# EAGLE board elements_v02 (EAGLE 9.6.2)
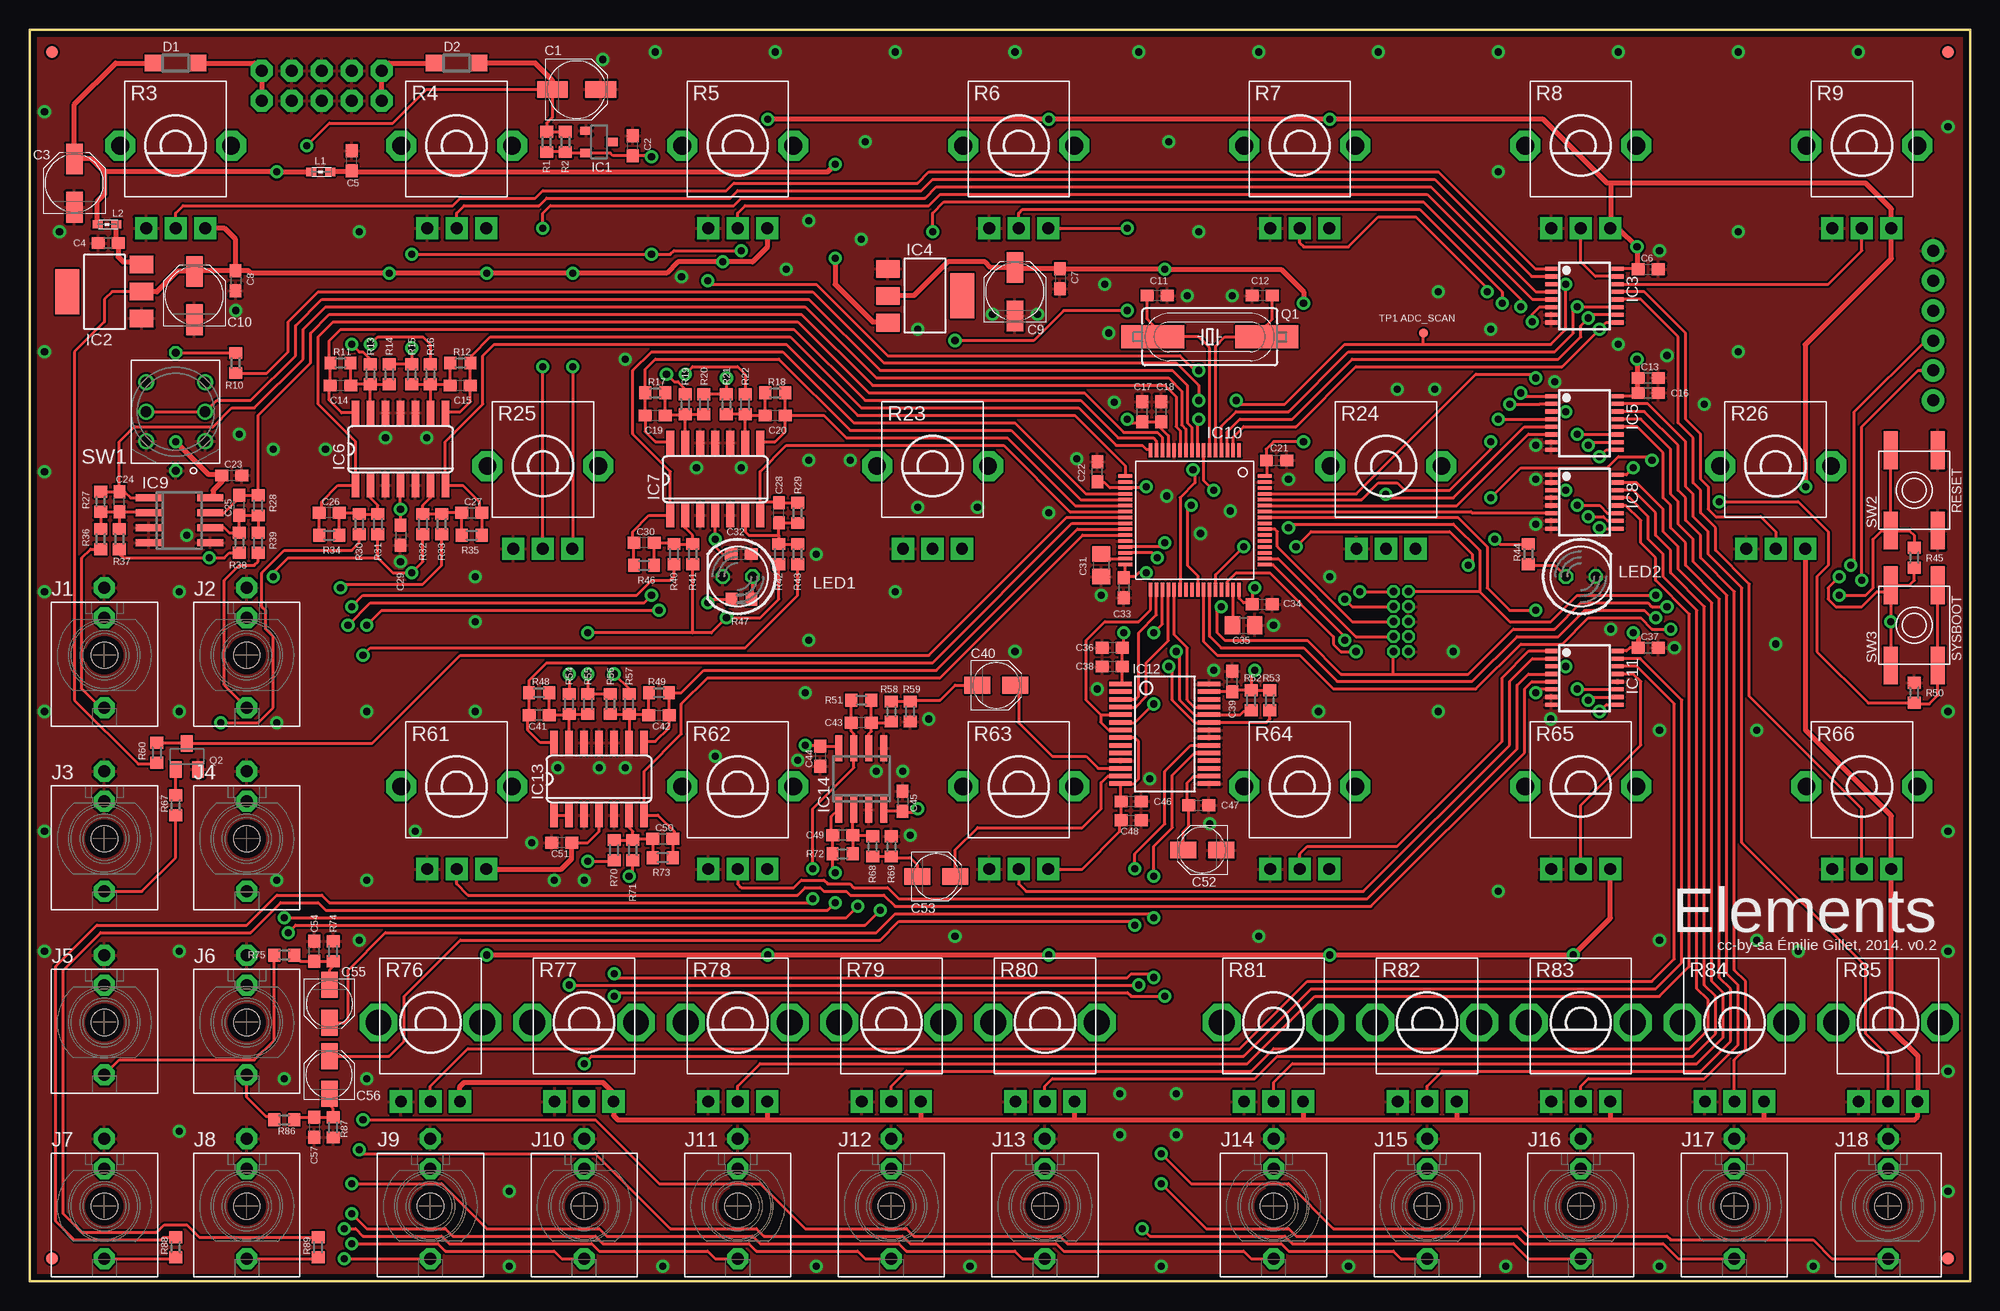
[diagram p5: board, top side]
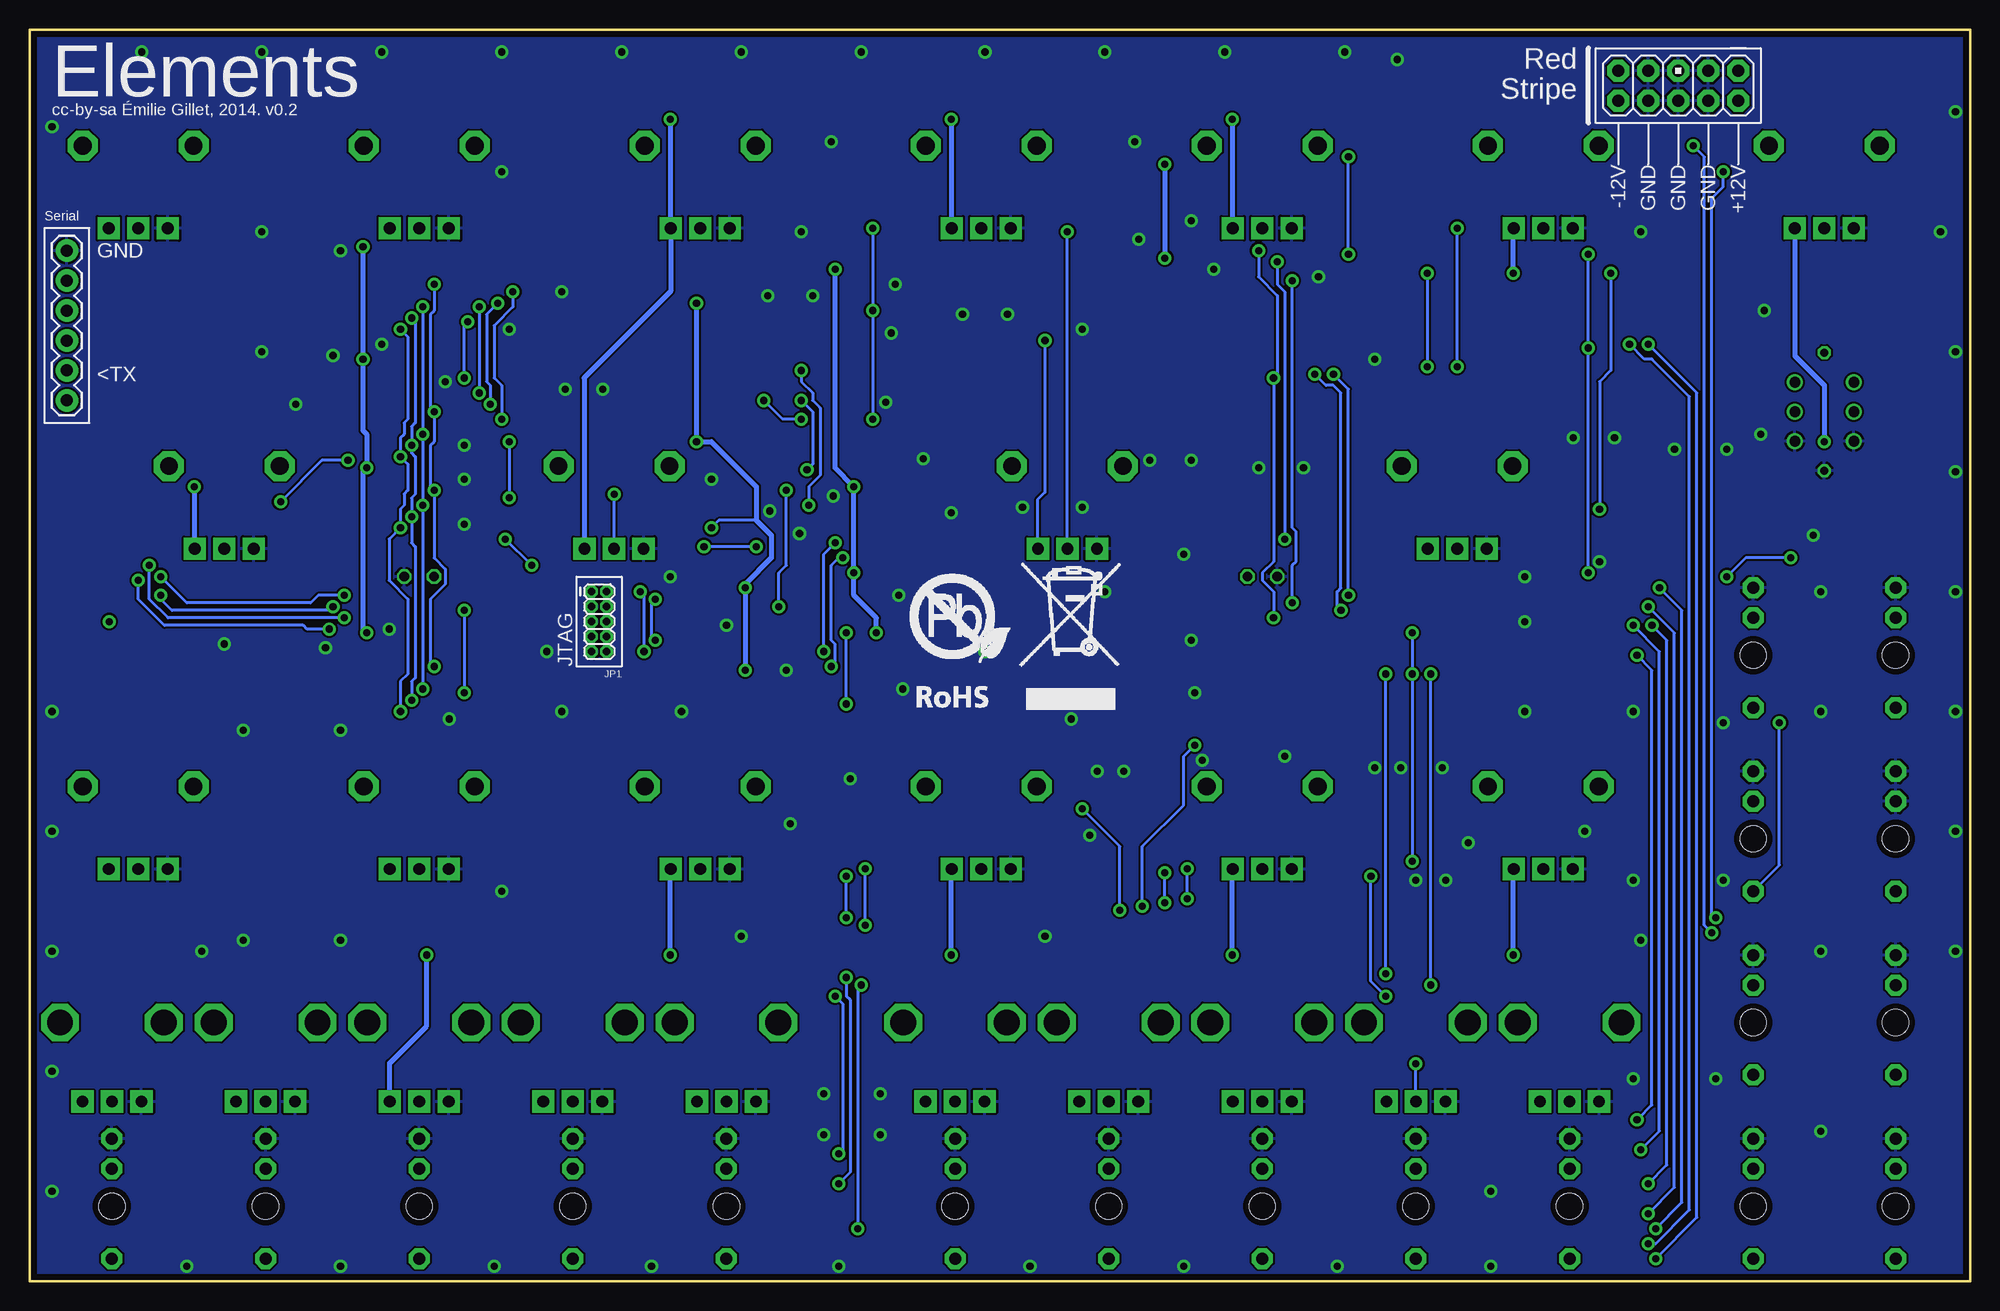
[diagram p6: board, bottom side, seen from below]

Size 164.47 x 106.05 mm. Coordinates in mm from the lower left corner, seen from the top.
Outline: 0,0 164.47,0 164.47,106.05 0,106.05 0,0
Copper layers (1*16): Top 0.035mm / dielectric 1.5mm / Bottom 0.035mm
Design rules "PCBCart-Standard-Fine": minimum track width 8mil, minimum drill 0.4mm, track to track 7mil, track to pad 7mil, pad to pad 7mil, via to via 7mil, smd to smd 7mil, copper to edge 20mil, drill to drill 8mil, minimum pad ring 8mil, minimum via ring 10mil, stop-mask expansion 3mil, vias tented up to drill 25mil, thermal gap 8mil

## Footprints (pad centres in the part's own frame; a part is rotated, then mirrored left to right if it is on the bottom)
PANASONIC_C = smd 2.6 x 1.4: + 2.05,0; - -2.05,0
C0603 = smd 1.1 x 1: 1 -0.85,0; 2 0.85,0
C0805 = smd 1.3 x 1.5: 1 -0.95,0; 2 0.95,0
PANASONIC_B = smd 2.2 x 1.4: + 1.6,0; - -1.6,0
SOD123 = smd 1.4 x 1.4: A 1.9,0; C -1.9,0
FIDUCIAL-1X2 = smd 1 x 1: 1 0,0
DBZ_R-PDSO-G3 = smd 0.7 x 1: 1 -0.95,-1.1; 2 0.95,-1.1; 3 0,1.1
SOT223 = smd 1.499 x 2.007: 1 -2.261,-3.15; 2 0.025,-3.15; 3 2.311,-3.15 | smd 3.81 x 2.007: 4 0,3.15
TSSOP16 = smd 0.35 x 1: 1 -1.95,-2.825; 2 -1.3,-2.825; 3 -0.65,-2.825; 4 0,-2.825; 5 0.65,-2.825; 6 1.3,-2.825; 7 1.95,-2.825; 8 2.6,-2.825; 9 2.6,2.825; 10 1.95,2.825; 11 1.3,2.825; 12 0.65,2.825; 13 0,2.825; 14 -0.65,2.825; 15 -1.3,2.825; 16 -1.95,2.825
SO14 = smd 0.66 x 2.032: 1 -3.81,-3.073; 2 -2.54,-3.073; 3 -1.27,-3.073; 4 0,-3.073; 5 1.27,-3.073; 6 2.54,-3.073; 7 3.81,-3.073; 8 3.81,3.073; 9 2.54,3.073; 10 1.27,3.073; 11 0,3.073; 12 -1.27,3.073; 13 -2.54,3.073; 14 -3.81,3.073
SO08 = smd 0.6 x 2.2: 1 -1.905,-2.6; 2 -0.635,-2.6; 3 0.635,-2.6; 4 1.905,-2.6; 5 1.905,2.6; 6 0.635,2.6; 7 -0.635,2.6; 8 -1.905,2.6
TQFP-10X10-64 = smd 1.2 x 0.3: 1 -5.936,3.75; 2 -5.936,3.25; 3 -5.936,2.75; 4 -5.936,2.25; 5 -5.936,1.75; 6 -5.936,1.25; 7 -5.936,0.75; 8 -5.936,0.25; 9 -5.936,-0.25; 10 -5.936,-0.75; 11 -5.936,-1.25; 12 -5.936,-1.75; 13 -5.936,-2.25; 14 -5.936,-2.75; 15 -5.936,-3.25; 16 -5.936,-3.75; 33 5.886,-3.75; 34 5.886,-3.25; 35 5.886,-2.75; 36 5.886,-2.25; 37 5.886,-1.75; 38 5.886,-1.25; 39 5.886,-0.75; 40 5.886,-0.25; 41 5.886,0.25; 42 5.886,0.75; 43 5.886,1.25; 44 5.886,1.75; 45 5.886,2.25; 46 5.886,2.75; 47 5.886,3.25; 48 5.886,3.75 | smd 0.3 x 1.2: 17 -3.75,-5.911; 18 -3.25,-5.911; 19 -2.75,-5.911; 20 -2.25,-5.911; 21 -1.75,-5.911; 22 -1.25,-5.911; 23 -0.75,-5.911; 24 -0.25,-5.911; 25 0.25,-5.911; 26 0.75,-5.911; 27 1.25,-5.911; 28 1.75,-5.911; 29 2.25,-5.911; 30 2.75,-5.911; 31 3.25,-5.911; 32 3.75,-5.911; 49 3.75,5.936; 50 3.25,5.936; 51 2.75,5.936; 52 2.25,5.936; 53 1.75,5.936; 54 1.25,5.936; 55 0.75,5.936; 56 0.25,5.936; 57 -0.25,5.936; 58 -0.75,5.936; 59 -1.25,5.936; 60 -1.75,5.936; 61 -2.25,5.936; 62 -2.75,5.936; 63 -3.25,5.936; 64 -3.75,5.936
SSOP28 = smd 0.381 x 1.905: 1 -4.55,-3.752; 2 -3.9,-3.752; 3 -3.25,-3.752; 4 -2.6,-3.752; 5 -1.95,-3.752; 6 -1.3,-3.752; 7 -0.65,-3.752; 8 0,-3.752; 9 0.65,-3.752; 10 1.3,-3.752; 11 1.95,-3.752; 12 2.6,-3.752; 13 3.25,-3.752; 14 3.9,-3.752; 15 3.9,3.752; 16 3.25,3.752; 17 2.6,3.752; 18 1.95,3.752; 19 1.3,3.752; 20 0.65,3.752; 21 0,3.752; 22 -0.65,3.752; 23 -1.3,3.752; 24 -1.95,3.752; 25 -2.6,3.752; 26 -3.25,3.752; 27 -3.9,3.752; 28 -4.55,3.752
WQP_PJ_301M6 = drill 1.016 pad 1.778 octagon: P1 0,-5.715; P2 0,-3.175; P3 0,4.445 | hole 2.2: 0,0
2X5-1.27 = drill 0.61 pad 1.067 octagon: 1 -1.27,3.81; 2 0,3.81; 3 -1.27,2.54; 4 0,2.54; 5 -1.27,1.27; 6 0,1.27; 7 -1.27,0; 8 0,0; 9 -1.27,-1.27; 10 0,-1.27
1X06 = drill 1.016 pad 1.88: 1 0,0; 2 2.54,0; 3 5.08,0; 4 7.62,0; 5 10.16,0; 6 12.7,0
AVR_ICSP = drill 1.016 pad 1.88 octagon: 1 -1.27,5.08; 2 1.27,5.08; 3 -1.27,2.54; 4 1.27,2.54; 5 -1.27,0; 6 1.27,0; 7 -1.27,-2.54; 8 1.27,-2.54; 9 -1.27,-5.08; 10 1.27,-5.08
0603 = smd 0.85 x 0.7: 1 -0.9,0; 2 0.7,0
LED5MM = drill 0.813 octagon: A -1.27,0; K 1.27,0
HC49UP = smd 5.334 x 1.93: 1 -4.826,0; 2 4.826,0
SOT23-BEC = smd 1 x 1.4: B -0.95,-1.1; C 0,1.1; E 0.95,-1.1
R0603 = smd 1 x 1.1: 1 -0.85,0; 2 0.85,0
ALPS_POT_VERTICAL_PS = drill 1 pad 1.88 square: P$1 -2.5,7; P$2 0,7; P$3 2.5,7 | drill 1.5 pad 2.54 octagon: P$4 -4.7,0; P$5 4.7,0
ALPS_POT_VERTICAL = drill 1 pad 1.88 square: P$1 -2.5,6.7; P$2 0,6.7; P$3 2.5,6.7 | drill 2.2 pad 3.175 octagon: P$4 -4.4,0; P$5 4.4,0
LP4OA1PBCT = drill 0.7 octagon: L1 5,0; L2 -5,0 | drill 0.9: P1 2.5,2.5; P2 0,2.5; P3 -2.5,2.5; P4 2.5,-2.5; P5 0,-2.5; P6 -2.5,-2.5
EVQ-Q2 = smd 3.2 x 1.2: A -3.4,-2; A' 3.4,-2; B -3.4,2; B' 3.4,2
PAD.03X.03 = smd 0.762 x 0.762: P$1 0,0

## Placement (x,y rotation side)
C1  22u  [PANASONIC_C]  46.35,100.97 0 top
C2  100n  [C0603]  51.12,96.2 90 top
C3  22u  [PANASONIC_C]  3.81,93.03 90 top
C4  100n  [C0603]  6.67,87.95 180 top
C5  100n  [C0603]  27.3,94.93 90 top
C6  100n  [C0603]  137.16,85.72 0 top
C7  100n  [C0603]  87.31,84.93 270 top
C8  100n  [C0603]  17.46,84.77 270 top
C9  22u  [PANASONIC_C]  83.5,83.82 90 top
C10  22u  [PANASONIC_C]  13.97,83.5 90 top
C11  18p  [C0603]  95.57,83.5 180 top
C12  18p  [C0603]  104.46,83.5 0 top
C13  100n  [C0603]  137.16,76.52 0 top
C14  3.3n  [C0603]  26.35,75.88 180 top
C15  3.3n  [C0603]  36.51,75.88 0 top
C16  100n  [C0603]  137.16,75.25 0 top
C17  1u  [C0603]  94.3,73.66 90 top
C18  100n  [C0603]  95.89,73.66 90 top
C19  3.3n  [C0603]  53.02,73.34 180 top
C20  3.3n  [C0603]  63.18,73.34 0 top
C21  100n  [C0603]  105.66,69.53 0 top
C22  100n  [C0603]  90.49,68.58 90 top
C23  100n  [C0603]  17.14,68.26 0 top
C24  3.3n  [C0603]  7.62,66.04 90 top
C25  3.3n  [C0603]  17.78,65.72 90 top
C26  3.3n  [C0603]  25.4,65.09 180 top
C27  3.3n  [C0603]  37.47,65.09 0 top
C28  3.3n  [C0603]  63.5,65.09 90 top
C29  100n  [C0603]  31.43,63.18 270 top
C30  3.3n  [C0603]  52.07,62.55 180 top
C31  2.2u  [C0805]  90.81,60.64 270 top
C32  100n  [C0603]  60.33,61.59 0 top
C33  100n  [C0603]  92.71,58.74 270 top
C34  100n  [C0603]  104.46,57.34 0 top
C35  2.2u  [C0805]  102.87,55.56 0 top
C36  1u  [C0603]  91.76,53.66 180 top
C37  100n  [C0603]  137.16,53.66 0 top
C38  100n  [C0603]  91.76,52.07 180 top
C39  100n  [C0603]  101.92,50.8 90 top
C40  10u  [PANASONIC_B]  81.92,50.48 0 top
C41  3.3n  [C0603]  43.18,47.94 180 top
C42  3.3n  [C0603]  53.34,47.94 0 top
C43  18p  [C0603]  70.48,47.31 180 top
C44  100n  [C0603]  66.99,44.45 270 top
C45  100n  [C0603]  73.98,40.64 270 top
C46  100n  [C0603]  93.34,40.64 0 top
C47  100n  [C0603]  99.06,40.32 0 top
C48  1u  [C0603]  93.34,39.05 0 top
C49  18p  [C0603]  68.9,37.78 180 top
C50  3.3n  [C0603]  53.66,37.47 0 top
C51  100n  [C0603]  45.09,37.15 180 top
C52  10u  [PANASONIC_B]  99.38,36.51 180 top
C53  10u  [PANASONIC_B]  76.83,34.29 0 top
C54  220p  [C0603]  24.13,27.94 90 top
C55  10u  [PANASONIC_B]  25.4,23.5 270 top
C56  10u  [PANASONIC_B]  25.4,17.46 90 top
C57  220p  [C0603]  24.13,13.02 270 top
D1  1N5819HW  [SOD123]  12.38,103.19 0 top
D2  1N5819HW  [SOD123]  36.2,103.19 0 top
F1  FIDUCIAL1X2  [FIDUCIAL-1X2]  1.91,104.14 0 top
F2  FIDUCIAL1X2  [FIDUCIAL-1X2]  162.56,104.14 0 top
F3  FIDUCIAL1X2  [FIDUCIAL-1X2]  1.91,1.91 0 top
F4  FIDUCIAL1X2  [FIDUCIAL-1X2]  162.56,1.91 0 top
IC1  LM4040B10  [DBZ_R-PDSO-G3]  48.26,96.52 270 top
IC2  LM1117-3.3  [SOT223]  6.35,83.82 90 top
IC3  4051PW  [TSSOP16]  131.76,83.82 270 top
IC4  LM1117-3.3  [SOT223]  75.88,83.5 270 top
IC5  4051PW  [TSSOP16]  131.76,73.03 270 top
IC6  MCP6004  [SO14]  31.43,70.48 0 top
IC7  MCP6004  [SO14]  58.1,67.94 0 top
IC8  4051PW  [TSSOP16]  131.76,66.36 270 top
IC9  MCP6002  [SO08]  12.7,64.45 270 top
IC10  STM32F405RGT6  [TQFP-10X10-64]  98.74,64.45 270 top
IC11  4051PW  [TSSOP16]  131.76,51.44 270 top
IC12  WM8731  [SSOP28]  96.2,46.04 270 top
IC13  MCP6004  [SO14]  48.26,42.55 0 top
IC14  LME49720  [SO08]  70.48,42.55 0 top
J1  PJ301_THONKICONN6  [WQP_PJ_301M6]  6.35,53.02 180 top
J2  PJ301_THONKICONN6  [WQP_PJ_301M6]  18.41,53.02 180 top
J3  PJ301_THONKICONN6  [WQP_PJ_301M6]  6.35,37.47 180 top
J4  PJ301_THONKICONN6  [WQP_PJ_301M6]  18.41,37.47 180 top
J5  PJ301_THONKICONN6  [WQP_PJ_301M6]  6.35,21.91 180 top
J6  PJ301_THONKICONN6  [WQP_PJ_301M6]  18.41,21.91 180 top
J7  PJ301_THONKICONN6  [WQP_PJ_301M6]  6.35,6.35 180 top
J8  PJ301_THONKICONN6  [WQP_PJ_301M6]  18.41,6.35 180 top
J9  PJ301_THONKICONN6  [WQP_PJ_301M6]  33.97,6.35 180 top
J10  PJ301_THONKICONN6  [WQP_PJ_301M6]  46.99,6.35 180 top
J11  PJ301_THONKICONN6  [WQP_PJ_301M6]  60.01,6.35 180 top
J12  PJ301_THONKICONN6  [WQP_PJ_301M6]  73.03,6.35 180 top
J13  PJ301_THONKICONN6  [WQP_PJ_301M6]  86.04,6.35 180 top
J14  PJ301_THONKICONN6  [WQP_PJ_301M6]  105.41,6.35 180 top
J15  PJ301_THONKICONN6  [WQP_PJ_301M6]  118.43,6.35 180 top
J16  PJ301_THONKICONN6  [WQP_PJ_301M6]  131.44,6.35 180 top
J17  PJ301_THONKICONN6  [WQP_PJ_301M6]  144.46,6.35 180 top
J18  PJ301_THONKICONN6  [WQP_PJ_301M6]  157.48,6.35 180 top
JP1  M05X2MINIJTAG  [2X5-1.27]  115.57,54.61 0 bottom
JP2  [1X06]  161.29,87.31 270 bottom
JP3  M05X2PTH  [AVR_ICSP]  24.77,101.28 270 bottom
L1  [0603]  24.77,93.98 0 top
L2  [0603]  6.67,89.53 0 top
LED1  SSL-LX5093TC  [LED5MM]  60.01,59.69 180 top
LED2  SSL-LX5093PC  [LED5MM]  131.44,59.69 0 top
Q1  8MHz  [HC49UP]  100.01,80.01 0 top
Q2  MMBT3904  [SOT23-BEC]  13.34,44.45 0 top
R1  1.0k  [R0603]  43.81,96.52 270 top
R2  1.0k  [R0603]  45.4,96.52 270 top
R3  10kB  [ALPS_POT_VERTICAL_PS]  12.38,96.2 180 top
R4  10kB  [ALPS_POT_VERTICAL_PS]  36.2,96.2 180 top
R5  10kB  [ALPS_POT_VERTICAL_PS]  60.01,96.2 180 top
R6  10kB  [ALPS_POT_VERTICAL_PS]  83.82,96.2 180 top
R7  10kB  [ALPS_POT_VERTICAL_PS]  107.63,96.2 180 top
R8  10kB  [ALPS_POT_VERTICAL_PS]  131.44,96.2 180 top
R9  10kB  [ALPS_POT_VERTICAL_PS]  155.26,96.2 180 top
R10  33  [R0603]  17.46,77.79 90 top
R11  20k  [R0603]  26.35,77.79 0 top
R12  20k  [R0603]  36.51,77.79 180 top
R13  100k  [R0603]  28.89,76.83 90 top
R14  120k  [R0603]  30.48,76.83 90 top
R15  120k  [R0603]  32.38,76.83 90 top
R16  100k  [R0603]  33.97,76.83 90 top
R17  20k  [R0603]  53.02,75.25 0 top
R18  20k  [R0603]  63.18,75.25 180 top
R19  100k  [R0603]  55.56,74.3 90 top
R20  120k  [R0603]  57.15,74.3 90 top
R21  120k  [R0603]  59.05,74.3 90 top
R22  100k  [R0603]  60.64,74.3 90 top
R23  10kB  [ALPS_POT_VERTICAL_PS]  76.52,69.06 180 top
R24  10kB  [ALPS_POT_VERTICAL_PS]  114.94,69.06 180 top
R25  10kB  [ALPS_POT_VERTICAL_PS]  43.5,69.06 180 top
R26  10kB  [ALPS_POT_VERTICAL_PS]  147.96,69.06 180 top
R27  47k  [R0603]  6.03,66.04 270 top
R28  20k  [R0603]  19.37,65.72 270 top
R29  20k  [R0603]  65.09,65.09 270 top
R30  100k  [R0603]  27.94,64.14 270 top
R31  200k  [R0603]  29.53,64.14 270 top
R32  120k  [R0603]  33.34,64.14 270 top
R33  100k  [R0603]  34.92,64.14 270 top
R34  33k  [R0603]  25.4,63.18 0 top
R35  20k  [R0603]  37.47,63.18 180 top
R36  100k  [R0603]  6.03,62.87 270 top
R37  180k  [R0603]  7.62,62.87 270 top
R38  120k  [R0603]  17.78,62.55 270 top
R39  100k  [R0603]  19.37,62.55 270 top
R40  100k  [R0603]  54.61,61.59 270 top
R41  120k  [R0603]  56.2,61.59 270 top
R42  120k  [R0603]  63.5,61.59 270 top
R43  100k  [R0603]  65.09,61.59 270 top
R44  2.2k  [R0603]  127,61.59 270 top
R45  10k  [R0603]  159.7,61.28 270 top
R46  20k  [R0603]  52.07,60.64 0 top
R47  2.2k  [R0603]  60.33,57.78 0 top
R48  20k  [R0603]  43.18,49.85 0 top
R49  20k  [R0603]  53.34,49.85 180 top
R50  10k  [R0603]  159.7,49.85 270 top
R51  47k  [R0603]  70.48,49.21 0 top
R52  2.2k  [R0603]  103.5,49.21 90 top
R53  2.2k  [R0603]  105.09,49.21 90 top
R54  100k  [R0603]  45.72,48.9 90 top
R55  120k  [R0603]  47.31,48.9 90 top
R56  120k  [R0603]  49.21,48.9 90 top
R57  100k  [R0603]  50.8,48.9 90 top
R58  6.8k  [R0603]  73.03,48.26 90 top
R59  47k  [R0603]  74.61,48.26 90 top
R60  10k  [R0603]  10.79,44.77 270 top
R61  10kB  [ALPS_POT_VERTICAL_PS]  36.2,41.91 180 top
R62  10kB  [ALPS_POT_VERTICAL_PS]  60.01,41.91 180 top
R63  10kB  [ALPS_POT_VERTICAL_PS]  83.82,41.91 180 top
R64  10kB  [ALPS_POT_VERTICAL_PS]  107.63,41.91 180 top
R65  10kB  [ALPS_POT_VERTICAL_PS]  131.44,41.91 180 top
R66  10kB  [ALPS_POT_VERTICAL_PS]  155.26,41.91 180 top
R67  100k  [R0603]  12.38,40.32 90 top
R68  6.8k  [R0603]  71.44,36.83 270 top
R69  47k  [R0603]  73.03,36.83 270 top
R70  120k  [R0603]  49.53,36.51 270 top
R71  100k  [R0603]  51.12,36.51 270 top
R72  47k  [R0603]  68.9,36.2 0 top
R73  20k  [R0603]  53.66,35.88 180 top
R74  6.8k  [R0603]  25.72,27.94 270 top
R75  36k  [R0603]  21.59,27.62 180 top
R76  10kB  [ALPS_POT_VERTICAL]  33.97,21.91 180 top
R77  10kB  [ALPS_POT_VERTICAL]  46.99,21.91 180 top
R78  10kB  [ALPS_POT_VERTICAL]  60.01,21.91 180 top
R79  10kB  [ALPS_POT_VERTICAL]  73.03,21.91 180 top
R80  10kB  [ALPS_POT_VERTICAL]  86.04,21.91 180 top
R81  10kB  [ALPS_POT_VERTICAL]  105.41,21.91 180 top
R82  10kB  [ALPS_POT_VERTICAL]  118.43,21.91 180 top
R83  10kB  [ALPS_POT_VERTICAL]  131.44,21.91 180 top
R84  10kB  [ALPS_POT_VERTICAL]  144.46,21.91 180 top
R85  10kB  [ALPS_POT_VERTICAL]  157.48,21.91 180 top
R86  36k  [R0603]  21.59,13.65 180 top
R87  6.8k  [R0603]  25.72,13.02 90 top
R88  1.0k  [R0603]  12.38,2.86 90 top
R89  1.0k  [R0603]  24.45,2.86 90 top
SW1  LP4OA1PBCT  [LP4OA1PBCT]  12.38,73.66 90 top
SW2  [EVQ-Q2]  159.7,66.99 90 top
SW3  [EVQ-Q2]  159.7,55.56 90 top
TP1  ADC_TEST  [PAD.03X.03]  118.11,80.33 0 top
U$2  [ROHS_BIG]  91.12,47.62 0 bottom

## Tracks (layer width: path | path; a pad name or v marks a point on that pad's centre or on a via)
+3V3  (via drill 0.6)
  Top 0.254: R45.2 159.7,59.37 159.29,58.96 SW3.B' | R52.2 R53.2 | R52.2 102.03,50.06 C39.1 101.91,49.94 IC12.27 | IC10.48 102.49,57.84 102.87,57.47 103.48,57.47 C34.1 103.61,58.52 v103.82,58.74 | 122.87,58.42 JP1.1 | 122.87,58.42 125.41,55.88 128.91,55.88 131.13,58.1 v137.79,58.1 | R52.2 103.5,51.44 v103.82,51.75 | IC10.64 104.81,68.34 C21.1 104.78,69.57 104.78,70.48 105.41,71.12 v107.95,71.12 | IC12.1 92.61,50.74 C38.1 C36.1 92.71,53.76 v92.71,54.93 | 92.81,59.69 C33.1 | 92.81,59.69 93.66,59.69 93.98,60.01 v94.61,60.01 | 92.81,59.69 92.83,59.71 IC10.32 | v94.61,67.31 94.51,67.2 IC10.19 91.55,67.2 91.12,67.63 90.59,67.63 C22.1 | SW3.B' v157.7,55.88 SW3.B | v106.68,63.82 107,64.14 120.65,64.14 122.87,61.91 122.87,58.42 | SW3.B' 157.16,58.42 156.53,58.42 155.26,57.15 153.03,57.15 152.4,57.78 152.4,58.74 v153.35,59.69
  Top 0.406: IC4.2 72.76,83.5 74.93,83.5 77.79,86.36 80.96,86.36 81.45,85.87 C9.+ 83.59,85.78 C7.1 87.37,85.72 v96.2,85.72 106.05,85.72 107.95,83.82 v107.95,82.87
  Bottom 0.254: v153.35,59.69 151.13,57.47 140.65,57.47 140.02,58.1 v137.79,58.1 | v106.68,63.82 106.05,64.45 102.87,64.45
  Bottom 0.406: v107.95,82.87 v107.95,71.12 106.68,71.12 102.87,67.31 102.87,64.45 101.6,63.18 101.6,61.28 103.82,59.05 v103.82,58.74 v103.82,51.75 | v92.71,54.93 92.71,56.2 94.61,58.1 v94.61,60.01 v94.61,67.31 96.2,68.9 v96.2,85.72
+3V3_A  (via drill 0.6)
  Top 0.254: C37.1 136.26,53.7 136.22,53.66 135.57,53.66 135.3,53.38 IC11.16 | 136.21,85.83 136.15,85.77 IC3.16 | IC5.16 135.83,74.97 136.21,75.35 136.31,75.45 C13.1 | IC12.8 93.66,46.04 93.98,45.72 93.98,42.55 93.57,42.14 IC12.14 92.45,40.69 C46.1 C48.1 92.39,38.95 92.39,38.1 89.2,34.91 R63.P$1 | C18.1 95.89,72.23 96.49,71.62 IC10.13 | C18.1 | C18.1 C17.1 94.19,72.71 93.34,72.71 v93.03,73.03 | v93.03,89.22 93.01,89.2 R6.P$1 | C29.1 v31.43,65.41 IC6.4 | C51.1 47.31,37.15 48.26,38.1 IC13.4 | R60.2 10.69,43.81 9.21,43.81 3.81,49.21 3.81,78.74 6.35,81.28 6.35,83.19 7.01,83.84 IC2.2 | R25.P$1 46.04,62.1 v46.04,77.47 | IC7.4 v58.1,62.87 58.1,62.23 58.74,61.59 C32.1 | v78.42,79.69 85.09,79.69 87.63,82.23 v93.03,82.23 | v135.89,68.9 135.3,68.31 IC8.16
  Top 0.406: 88.58,13.65 107.95,13.65 | 107.95,13.65 120.97,13.65 | 120.97,13.65 133.99,13.65 | 133.99,13.65 147,13.65 | 147,13.65 159.7,13.65 159.98,13.93 R85.P$1 160.02,15.25 160.02,19.05 157.76,21.31 R66.P$1 157.76,39.41 150.5,46.67 150.5,62.02 R26.P$1 | R84.P$1 147,15.17 147,13.65 | R83.P$1 133.99,15.17 133.99,13.65 | R82.P$1 120.97,15.17 120.97,13.65 | R81.P$1 107.95,15.17 107.95,13.65 | R80.P$1 88.58,15.17 88.58,13.65 | v62.55,98.42 v86.36,98.42 v110.17,98.42 128.27,98.42 133.67,93.03 133.99,93.03 | C8.1 14.04,85.62 C10.+ 12.53,85.55 10.79,83.82 9.53,83.82 IC2.2 | C6.1 136.21,85.83 v136.21,87.63 134.63,89.2 R8.P$1 133.99,89.24 133.99,93.03 | C16.1 136.21,75.35 v136.21,78.11 | v38.73,27.62 v62.55,27.62 v86.36,27.62 v110.17,27.62 v130.81,27.62 133.94,30.76 R65.P$1 | 133.99,93.03 155.57,93.03 157.76,90.84 R9.P$1 157.76,86.64 150.46,79.33 150.5,79.3 v150.5,67.31 | R76.P$1 36.47,16.47 36.83,16.83 48.58,16.83 49.49,15.91 R77.P$1 49.49,14.01 49.85,13.65 62.55,13.65 | 62.55,15.25 R78.P$1 62.55,15.17 62.55,13.65 | 75.56,13.65 88.58,13.65 | R79.P$1 75.56,15.17 75.56,13.65 | C51.1 45.94,35.77 45.07,34.91 R61.P$1 | R5.P$1 62.51,87.59 61.28,86.36 v58.74,86.36 54.93,86.36 53.98,85.41 v46.04,85.41 v38.73,85.41 v30.48,85.41 18.73,85.41 18.52,85.62 C8.1 | v12.38,71.12 15.14,68.36 16.3,68.36 C23.1 16.3,67.73 15.56,66.99 15.56,66.61 IC9.8 | C8.1 17.46,88.27 16.52,89.2 R3.P$1 | 62.55,13.65 75.56,13.65 | v135.89,54.93 136.31,54.51 C37.1
  Bottom 0.254: v93.03,89.22 v93.03,82.23 v93.03,73.03 | v31.43,65.41 31.43,76.2 30.48,77.15 v30.48,85.41 | v46.04,85.41 v46.04,77.47 | v58.74,86.36 58.74,84.45 58.1,83.82 v58.1,62.87 | R23.P$1 79.06,62.1 79.06,66.2 78.42,66.83 v78.42,79.69
  Bottom 0.406: R5.P$1 62.55,89.24 v62.55,98.42 | R6.P$1 86.36,89.24 v86.36,98.42 | v110.17,98.42 110.17,89.24 R7.P$1 110.13,83.86 117.47,76.52 117.47,62.1 R24.P$1 | v135.89,54.93 136.21,55.24 136.21,68.58 v135.89,68.9 135.89,71.75 136.21,72.07 v136.21,78.11 v136.21,87.63 | R9.P$1 157.8,89.24 | R83.P$1 133.94,18.45 130.81,21.59 v130.81,27.62 | R61.P$1 38.73,34.87 v38.73,27.62 | R62.P$1 62.55,34.87 v62.55,27.62 | R63.P$1 86.36,34.87 v86.36,27.62 | R64.P$1 110.17,34.87 v110.17,27.62 | v150.5,67.31 150.46,67.27 R26.P$1 | v12.38,71.12 12.38,75.88 14.88,78.38 R3.P$1 | R4.P$1 38.73,89.16 v38.73,85.41
ADC_ADDR_0  (via drill 0.6)
  Top 0.254: IC3.11 134.56,82.55 v131.13,82.55 130.81,82.23 130.81,80.33 129.22,78.74 111.76,78.74 106.68,73.66 102.23,73.66 100.99,72.42 IC10.4 100.97,70.42 | v131.13,50.16 131.16,50.13 IC11.11 | IC5.11 134.56,71.75 v131.13,71.75 | 134.56,65.09 IC8.11 133.7,65.06 133.03,65.72 v131.13,65.72
  Bottom 0.254: v131.13,50.16 v131.13,65.72 v131.13,71.75 v131.13,82.55
ADC_ADDR_1  (via drill 0.6)
  Top 0.254: IC3.10 134.54,81.92 132.4,81.92 v132.08,81.6 131.44,80.96 131.44,80.01 129.54,78.11 112.08,78.11 107,73.03 102.55,73.03 101.49,71.97 IC10.3 | v132.08,49.21 132.35,49.48 IC11.10 | v132.08,70.8 132.35,71.08 IC5.10 | v132.08,64.77 133.35,64.77 133.71,64.41 IC8.10
  Bottom 0.254: v132.08,49.21 132.08,50.8 131.76,51.12 131.76,62.23 132.08,62.55 v132.08,64.77 132.08,66.36 131.76,66.67 131.76,69.85 132.08,70.17 v132.08,70.8 132.08,72.39 131.76,72.71 131.76,81.28 v132.08,81.6
ADC_ADDR_2  (via drill 0.6)
  Top 0.254: IC3.9 133.61,81.22 v133.03,80.64 129.86,77.47 112.39,77.47 107.31,72.39 102.87,72.39 101.99,71.51 IC10.2 | v133.03,69.85 133.61,70.42 IC5.9 | v133.03,48.26 133.61,48.84 IC11.9 | v133.03,63.82 133.09,63.76 IC8.9
  Bottom 0.254: v133.03,80.64 132.4,80.01 132.4,73.03 132.72,72.71 132.72,71.75 133.03,71.44 v133.03,69.85 132.4,69.22 132.4,66.99 132.72,66.67 132.72,65.72 133.03,65.41 v133.03,63.82 133.99,62.87 133.99,59.37 132.4,57.78 132.4,51.44 133.03,50.8 v133.03,48.26
ADC_BANK_0  (via drill 0.6)
  Top 0.254: IC11.6 128.91,50.16 127.95,50.16 v127.64,49.85 | IC10.57 121.03,64.7 123.51,62.23 123.51,58.74 125.41,56.83 v127.64,56.83
  Bottom 0.254: v127.64,56.83 v127.64,49.85
ADC_BANK_1
  Top 0.254: IC8.6 128.91,65.09 122.24,65.09 122.12,65.2 IC10.58
ADC_BANK_2
  Top 0.254: IC5.6 128.91,71.75 127,71.75 120.95,65.7 IC10.59
ADC_BANK_3  (via drill 0.6)
  Top 0.254: IC3.6 128.91,82.55 127.95,82.55 127.32,81.92 v127.32,81.28 | v127.64,76.52 127.32,76.83 122.56,76.83 112.42,66.7 IC10.61
  Bottom 0.254: v127.32,81.28 127.64,80.96 v127.64,76.52
ADC_BLOW_SHAPE
  Top 0.254: IC10.16 94.9,70.48 94.61,70.48 94.3,70.8 92.08,70.8 88.9,73.98 70.48,73.98 64.45,80.01 39.05,80.01 37.47,78.42 37.47,77.89 R12.1 C15.2 37.36,74.51 36.51,73.66 35.34,73.66 IC6.8
ADC_BLOW_TIMBRE
  Top 0.254: IC10.17 92.83,69.09 88.58,73.34 70.17,73.34 64.14,79.38 39.37,79.38 38.42,78.42 38.42,74.3 35.24,71.12 IC6.7 36.73,67.41 38.1,66.04 38.1,65.3 C27.2 R35.1
ADC_BOW_TIMBRE
  Top 0.254: IC10.15 95.49,71.19 95.25,71.44 92.23,71.44 89.06,74.61 70.8,74.61 64.77,80.64 26.35,80.64 25.4,79.69 25.4,77.89 R11.1 C14.2 25.4,75.78 25.4,74.61 26.45,73.56 IC6.14
ADC_BRIGHTNESS
  Top 0.254: IC13.8 52.17,45.72 53.02,45.72 54.19,46.89 C42.2 R49.1 55.24,49.85 57.15,51.75 76.83,51.75 88.78,63.7 IC10.26
ADC_DAMPING
  Top 0.254: IC10.22 88.6,65.7 82.87,71.44 69.22,71.44 67.31,73.34 C20.2 | IC7.8 62.01,71.12 63.18,71.12 64.03,71.97 C20.2 | C20.2 R18.1
ADC_FM
  Top 0.254: 97.47,70.41 IC10.11 97.49,72.05 97.16,72.39 97.16,74.93 96.2,75.88 71.44,75.88 65.41,81.92 25.4,81.92 23.81,80.33 23.81,77.79 19.37,73.34 R28.1 C25.2 17.78,66.36 16.51,65.09 IC9.7
ADC_GEOMETRY
  Top 0.254: IC10.23 88.15,65.2 82.55,70.8 64.14,70.8 61.91,68.58 61.91,66.04 | IC7.7 61.91,66.04 | R29.1 C28.2 63.4,66.04 61.91,66.04
ADC_POSITION
  Top 0.254: IC10.25 88.33,64.2 76.52,52.39 43.81,52.39 42.33,50.9 R48.1 C41.2 42.23,47.84 42.23,46.67 43.28,45.62 IC13.14
ADC_POTS  (via drill 0.6)
  Top 0.254: IC8.3 128.95,66.99 v130.18,66.99 | v130.18,52.07 130.16,52.09 IC11.3 | IC5.3 128.95,73.66 v130.18,73.66 | IC3.3 128.95,84.45 v130.18,84.45 130.18,80.64 128.91,79.38 118.11,79.38 | v102.23,74.61 102.55,74.3 106.36,74.3 111.44,79.38 118.11,79.38 | v99.06,73.03 98.99,72.96 IC10.8 | 118.11,79.38 TP1.P$1
  Bottom 0.254: v130.18,84.45 130.18,82.23 130.49,81.92 130.49,73.98 v130.18,73.66 130.18,71.12 130.49,70.8 130.49,67.31 v130.18,66.99 130.18,61.28 129.22,60.33 129.22,59.05 130.49,57.78 130.49,52.39 v130.18,52.07 | v102.23,74.61 100.65,73.03 v99.06,73.03
ADC_PRESSURE
  Top 0.254: IC10.14 95.99,71.49 95.57,71.91 92.71,71.91 89.38,75.25 71.12,75.25 65.09,81.28 25.72,81.28 24.45,80.01 24.45,74.3 27.62,71.12 IC6.1 26.14,67.41 24.77,66.04 24.77,65.3 C26.2 R34.1
ADC_SPACE
  Top 0.254: R73.1 C50.2 54.61,37.57 54.61,38.1 53.24,39.47 IC13.7 | IC10.27 89.24,63.2 77.15,51.12 57.47,51.12 55.24,48.9 55.24,46.35 52.07,43.18 IC13.7 | IC13.7 52.29,39.69
ADC_STRIKE_SHAPE
  Top 0.254: 92.8,66.67 IC10.20 89.51,66.7 83.5,72.71 69.85,72.71 63.82,78.74 52.7,78.74 51.12,77.15 51.12,71.75 54.29,68.58 IC7.1 52.49,64.87 51.12,63.5 51.12,62.65 C30.2 R46.1
ADC_STRIKE_TIMBRE
  Top 0.254: IC10.21 89.06,66.2 83.19,72.07 69.53,72.07 63.5,78.11 53.02,78.11 52.17,77.25 R17.1 C19.2 52.17,71.97 53.02,71.12 54.19,71.12 IC7.14
ADC_V_OCT
  Top 0.254: IC10.10 97.99,72.19 97.63,72.55 97.63,75.41 96.52,76.52 71.75,76.52 65.72,82.55 25.08,82.55 23.18,80.64 23.18,78.11 19.05,73.98 17.14,73.98 15.56,72.39 8.89,72.39 7.62,71.12 C24.2 | R27.1 C24.2 | IC9.1 8.57,66.36 8.04,66.89 C24.2
AREF_-10  (via drill 0.6)
  Top 0.254: R56.2 R55.2 v47.31,51.44 | R70.2 49.43,35.56 v47.31,35.56 | R20.2 R21.2 v59.05,76.52 | R14.2 R15.2 v32.38,79.06 | R32.2 33.34,60.96 v32.38,60.01 30.8,60.01 29.53,61.28 | R37.2 7.62,61.59 7.94,61.28 v15.24,61.28 16.51,61.28 16.93,61.7 R38.2 | v32.38,87 v52.7,87 54.29,87 54.61,87.31 v60.33,87.31 | 29.53,61.28 R31.2 | 29.53,61.28 21.91,61.28 20.64,60.01 v20.64,59.69 | R1.2 R2.2 45.5,95.57 IC1.2 49.21,95.57 49.43,95.35 C2.1 52.6,95.35 v52.7,95.25 | R42.2 63.5,57.78 61.91,56.2 v59.05,56.2 57.78,54.93 56.2,54.93 | 56.2,54.93 v47.31,54.93 | 56.2,54.93 R41.2
  Bottom 0.254: v47.31,35.56 v47.31,51.44 v47.31,54.93 | v32.38,87 v32.38,79.06 v32.38,60.01 | v60.33,87.31 60.33,85.09 58.74,83.5 58.74,76.83 v59.05,76.52 59.05,60.96 60.01,60.01 60.01,59.37 59.05,58.42 v59.05,56.2 | v52.7,87 v52.7,95.25 | v15.24,61.28 19.05,61.28 v20.64,59.69
BOOT_FLASH  (via drill 0.6)
  Top 0.254: SW3.A SW3.A' | SW3.A 161.61,52.07 | v143.19,66.04 149.86,66.04 152.4,63.5 152.4,60.64 151.45,59.69 151.45,53.34 155.79,49 R50.2 159.81,48.9 160.97,48.9 161.7,49.62 SW3.A | v123.83,66.36 126.36,68.9 133.67,68.9 134.62,69.85 137.16,69.85 v137.48,69.53 | IC10.60 112.88,66.2 114.3,67.63 115.89,67.63 116.52,66.99 120.33,66.99 123.83,70.48 v123.83,71.12
  Bottom 0.254: v143.19,66.04 139.7,69.53 v137.48,69.53 | v123.83,71.12 v123.83,66.36
GATE
  Top 0.254: R60.1 13.27,45.62 Q2.C 29.04,45.55 36.51,53.02 76.2,53.02 87.88,64.7 IC10.24
GND  (via drill 0.6)
  other vias: 138.75,78.42 138.11,87.31 139.38,53.66 105.41,55.56 100.01,38.73 98.11,83.5 101.92,83.5 100.33,51.75 90.49,50.16 106.68,67.94 90.81,58.1 123.83,80.64 127.64,70.8 127.64,64.14 127.64,67.94 128.91,47.62 71.75,43.18 74.61,37.78 65.09,44.13 94.93,42.55 91.92,74.45 96.36,66.52 101.76,65.25 17.46,82.23 85.41,81.92 17.78,71.75 13.34,63.18 31.43,60.96 88.74,69.69 66.67,61.59 42.55,37.15 48.26,43.5 56.52,68.9 30.16,71.44 73.98,43.18 75.25,80.64 81.6,81.92 75.25,65.56 80.33,65.56 60.33,68.9 33.66,71.44 91.12,84.45 115.89,75.56 119.06,75.56 134.62,79.38 141.92,74.3 133.99,55.24 129.22,76.2 92.39,15.88 97.16,15.88 97.16,12.38 92.39,12.38 28.57,17.14 21.59,17.14 20.95,33.97 28.57,33.97 28.57,48.26 20.95,47.31 25.08,70.48 20.64,70.48 2.54,88.9 48.58,103.5 76.2,47.62 65.72,49.85 69.53,69.53 66.04,69.53 66.04,89.85 70.48,88.27 66.04,54.29 27.94,28.89 46.99,33.97 44.45,33.97 50.48,43.5 44.77,43.5 138.11,46.67 146.37,46.67 86.36,65.09 50.48,78.11 64.14,85.72 27.94,88.9 73.34,58.42 37.78,48.26 124.46,33.02 119.38,48.26 120.65,53.34 119.38,83.82 144.78,78.74 149.86,27.94 78.42,29.21 104.14,29.21 83.5,53.34 37.78,59.69 37.78,55.88 138.11,28.89 146.37,28.89 124.46,93.98 96.52,96.52 70.8,96.52 53.02,104.14 63.18,104.14 73.34,104.14 83.5,104.14 93.98,104.14 104.14,104.14 114.3,104.14 124.46,104.14 134.62,104.14 144.78,104.14 154.94,104.14 162.56,97.79 162.56,7.62 162.56,17.78 162.56,27.94 162.56,38.1 162.56,48.26 151.13,1.27 138.11,1.27 125.09,1.27 12.7,12.7 12.7,27.94 12.7,48.26 12.7,58.42 1.27,99.06 1.27,78.74 1.27,68.58 1.27,58.42 1.27,48.26 1.27,38.1 1.27,27.94 111.76,1.27 95.89,1.27 79.69,1.27 66.67,1.27 53.66,1.27 40.64,1.27 144.78,88.9 99.06,88.9 109.22,48.26 58.1,44.45 32.7,38.1 55.24,85.09 99.22,63.34 110.17,59.69 91.44,80.33 40.64,7.62 147.96,53.98
  pour Bottom: 0,106.05 0,0 164.47,0 164.47,106.05
  pour Top: 0,106.05 164.47,106.05 164.47,0 0,0
I2C_SCL  (via drill 0.6)
  Top 0.254: R52.1 103.4,48.26 102.87,48.26 102.6,47.99 IC12.24 99.91,47.94 98.74,47.94 97.47,49.21 97.47,53.02 v97.16,53.34 | v96.2,62.55 95.86,62.2 IC10.29
  Bottom 0.254: v96.2,62.55 97.16,61.59 v97.16,53.34
I2C_SDA  (via drill 0.6)
  Top 0.254: R53.1 105.09,47.62 104.81,47.34 IC12.23 99.92,47.31 98.74,47.31 96.84,49.21 96.84,51.75 v96.52,52.07 | v95.57,61.28 95.14,61.7 IC10.30
  Bottom 0.254: v96.52,52.07 96.2,52.39 96.2,53.98 96.52,54.29 96.52,60.64 95.89,61.28 v95.57,61.28
I2S_LRCK
  Top 0.254: 92.41,47.94 IC12.5 90.76,47.99 | IC10.33 94.99,56.89 93.98,55.88 91.12,55.88 89.53,54.29 89.53,49.21 90.76,47.99 | IC12.7 92.44,46.67 91.44,46.67 90.76,47.35 90.76,47.99
I2S_MCK
  Top 0.254: IC12.25 98.68,48.64 98.11,49.21 98.11,53.66 96.99,54.77 IC10.37
I2S_SCK
  Top 0.254: 92.53,49.21 IC12.3 93.74,49.29 93.98,49.53 93.98,54.93 95.49,56.44 IC10.34
I2S_SIN  (via drill 0.6)
  Top 0.254: IC12.6 92.48,47.31 93.66,47.31 v95.25,48.9 | v95.25,54.93 95.99,55.67 IC10.35
  Bottom 0.254: v95.25,48.9 v95.25,54.93
I2S_SOUT
  Top 0.254: IC12.4 93.72,48.64 94.61,49.53 94.61,52.39 96.49,54.27 IC10.36
JTCK  (via drill 0.6)
  Top 0.254: v111.44,57.78 112.08,57.15 JP1.4 | v111.44,54.29 111.44,54.61 105.35,60.7 IC10.49
  Bottom 0.254: v111.44,54.29 111.76,54.61 111.76,57.47 v111.44,57.78
JTDI
  Top 0.254: JP1.8 112.39,54.61 105.8,61.2 IC10.50
JTDO
  Top 0.254: JP1.6 112.08,55.88 105.73,62.23 105.73,63.5 105.53,63.7 IC10.55
JTMS  (via drill 0.6)
  Top 0.254: IC10.46 101.49,59.27 102.23,60.01 105.09,60.01 110.49,54.61 110.49,53.98 111.12,53.34 v112.39,53.34 | v112.71,58.42 JP1.2
  Bottom 0.254: v112.39,53.34 112.39,58.1 v112.71,58.42
LED_GATE  (via drill 0.6)
  Top 0.254: 97.47,58.59 IC10.38 97.49,66.38 98.74,67.63 98.74,68.58 v98.58,68.74 | v99.06,74.61 99.06,75.88 97.16,77.79 72.39,77.79 66.36,83.82 24.45,83.82 21.91,81.28 21.91,78.74 20.11,76.94 R10.1
  Bottom 0.254: v98.58,68.74 98.11,69.22 98.11,73.66 v99.06,74.61
LIN  (via drill 0.6)
  Top 0.254: v93.66,30.16 93.34,30.48 73.66,30.48 72.07,28.89 36.51,28.89 31.75,24.13 31.75,20.32 30.48,19.05 30.47,19.06 C56.+ | v93.66,34.92 93.66,36.2 96.2,38.73 96.2,43.18 98.41,45.39 IC12.20
  Bottom 0.254: v93.66,30.16 v93.66,34.92
LOUT
  Top 0.254: C40.+ 83.82,50.18 83.82,47.31 86.68,44.45 89.53,44.45 90.55,43.44 IC12.12
LOUT_JACK
  Top 0.254: R89.1 24.34,1.91 J8.P3
N$1  (via drill 0.6)
  Top 0.254: v27.3,3.17 34.61,3.17 35.24,2.54 44.45,2.54 45.09,1.91 J10.P3 | R16.2 33.97,79.38 33.34,80.01 29.53,80.01 v28.89,79.38
  Bottom 0.254: v27.3,3.17 26.67,3.17 23.81,6.03 23.81,74.93 26.99,78.11 27.62,78.11 v28.89,79.38
N$2
  Top 0.254: R15.1 R16.1 | R16.1 IC6.9 | R16.1 35.56,75.98 C15.1 R12.2
N$3  (via drill 0.6)
  Top 0.254: v27.3,8.26 34.92,8.26 38.73,4.45 48.26,4.45 48.9,3.81 61.28,3.81 61.91,3.17 73.66,3.17 74.3,2.54 83.5,2.54 84.14,1.91 J13.P3 | v26.99,55.56 28.89,57.47 52.07,57.47 v52.7,58.1 | v53.98,76.83 54.61,76.2 54.93,76.2 55.56,75.56 R19.2
  Bottom 0.254: v52.7,58.1 52.7,75.56 v53.98,76.83 | v26.99,55.56 25.72,54.29 25.72,9.84 v27.3,8.26
N$4  (via drill 0.6)
  Top 0.254: v26.67,1.91 J9.P3 | v27.3,79.38 27.94,78.74 28.26,78.74 28.89,78.11 R13.2
  Bottom 0.254: v26.67,1.91 23.18,5.4 23.18,75.25 v27.3,79.38
N$5
  Top 0.254: R11.2 C14.1 27.3,75.98 R13.1 | IC6.13 R13.1 | R13.1 R14.1
N$6
  Top 0.254: R39.2 19.37,60.96 19.05,60.64 17.78,60.64 16.51,59.37 16.51,50.48 J2.P3
N$7
  Top 0.254: 104.78,80.07 Q1.2 | 104.78,80.07 104.78,80.96 105.31,81.5 C12.2 | 104.78,80.07 104.71,80.01 101.28,80.01 100.49,79.22 IC10.5
N$8
  Top 0.254: C11.2 94.72,81.5 95.25,80.96 95.25,80.07 Q1.1 95.25,79.95 95.31,80.01 99.06,80.01 99.99,79.08 IC10.6
N$9
  Top 0.254: IC7.13 R19.1 | R19.1 R20.1 | R17.2 C19.1 55.46,73.34 R19.1
N$10
  Top 0.254: J1.P3 6.03,48.58 4.45,50.16 4.45,61.28 5.18,62.02 R36.2
N$11
  Top 0.254: C24.1 R27.2 R36.1 | C24.1 7.52,65.09 | IC9.2 10,65.19 C24.1 | C24.1 R37.1
N$12  (via drill 0.6)
  Top 0.254: v27.94,11.11 28.26,10.79 47.94,10.79 54.29,4.45 61.59,4.45 62.23,3.81 73.98,3.81 74.61,3.17 87,3.17 87.63,2.54 102.87,2.54 103.5,1.91 J14.P3 | v28.57,55.56 29.84,56.83 v53.34,56.83 | v55.56,76.83 56.2,77.47 60.01,77.47 60.64,76.83 R22.2
  Bottom 0.254: v28.57,55.56 26.35,53.34 26.35,12.7 v27.94,11.11 | v53.34,56.83 53.66,57.15 53.66,58.42 53.34,58.74 53.34,75.25 53.98,75.88 54.61,75.88 v55.56,76.83
N$13
  Top 0.254: C35.1 101.99,55.63 IC10.47
N$14
  Top 0.254: R22.1 R21.1 | IC7.9 R22.1 | R22.1 60.74,73.34 C20.1 R18.2
N$15
  Top 0.254: IC9.6 16.51,63.82 16.93,63.4 R38.1 C25.1 R28.2 R39.1
N$16  (via drill 0.6)
  Top 0.254: v27.3,5.71 28.57,4.45 35.24,4.45 35.88,3.81 47.94,3.81 48.58,3.17 60.96,3.17 61.59,2.54 70.17,2.54 70.8,1.91 J12.P3 | v27.3,57.15 28.26,58.1 51.44,58.1 52.7,59.37 54.29,59.37 54.61,59.69 R40.2
  Bottom 0.254: v27.3,57.15 25.08,54.93 25.08,7.94 v27.3,5.71
N$17
  Top 0.254: IC12.16 98.67,42.79 98.11,42.23 98.11,40.42 C47.1 98.21,38.52 97.78,38.09 C52.+
N$18
  Top 0.254: R86.1 22.66,13.87 C57.1 R87.2 25.72,14.61 25.4,14.92 C56.-
N$19
  Top 0.254: C31.1 91.19,61.2 IC10.31
N$20
  Top 0.254: J5.P3 7.62,18.73 19.05,18.73 20.74,20.42 R75.2
N$21
  Top 0.254: R86.2 20.74,13.97 20,13.97 18.41,15.56 J6.P3
N$22
  Top 0.254: R75.1 22.97,27.09 C54.1 R74.2 25.72,26.67 25.4,26.35 C55.-
N$23
  Top 0.254: R58.2 R59.2 74.72,49.21 77.15,49.21 78.42,50.48 C40.-
N$24
  Top 0.254: IC7.2 55.56,63.82 56.2,63.18 R41.1 R40.1 54.51,62.55 C30.1 R46.2
N$25
  Top 0.254: IC14.6 71.12,46.35 71.33,46.57 C43.1 | R58.1 72.92,47.31 C43.1 | C43.1 R51.2
N$26  (via drill 0.6)
  Top 0.254: v26.67,4.45 27.62,4.45 28.26,3.81 34.92,3.81 35.56,3.17 47.62,3.17 48.26,2.54 57.47,2.54 58.1,1.91 J11.P3 | v26.35,58.74 26.67,59.05 33.34,59.05 34.92,60.64 R33.2
  Bottom 0.254: v26.67,4.45 24.45,6.67 24.45,56.83 v26.35,58.74
N$27
  Top 0.254: IC6.6 33.97,66.36 33.34,65.72 R32.1 R33.1 35.03,65.09 C27.1 R35.2
N$28  (via drill 0.6)
  Top 0.254: v66.36,34.92 66.36,40.01 69.85,43.5 IC14.7 69.85,46.35 69.64,46.57 C43.2 R51.1 | v66.36,32.38 66.04,32.07 25.4,32.07 24.77,32.7 20.95,32.7 18.41,30.16 5.71,30.16 2.22,26.67 2.22,5.08 3.81,3.49 11.11,3.49 11.33,3.71 R88.2
  Bottom 0.254: v66.36,32.38 v66.36,34.92
N$29  (via drill 0.6)
  Top 0.254: v95.25,25.72 94.93,26.04 93.34,26.04 93.03,25.72 49.85,25.72 v49.53,26.04 | v49.53,51.44 50.8,50.16 R57.2 | v95.89,8.26 99.69,4.45 106.68,4.45 107.31,3.81 126.05,3.81 126.68,3.17 138.43,3.17 139.7,1.91 J17.P3
  Bottom 0.254: v95.25,25.72 95.25,24.13 94.93,23.81 94.93,9.21 v95.89,8.26 | v49.53,26.04 v49.53,51.44
N$30
  Top 0.254: R57.1 IC13.9 | R56.1 R57.1 | R49.2 C42.1 52.39,48.05 R57.1
N$31
  Top 0.254: R68.2 R69.2 73.13,35.88 74.61,35.88 75.23,35.26 C53.-
N$32
  Top 0.254: IC14.2 69.75,39.84 C49.1 | C49.1 R72.2 | R68.1 71.33,37.78 C49.1
N$33  (via drill 0.6)
  Top 0.254: v68.26,32.07 67.63,31.43 25.08,31.43 24.45,32.07 21.27,32.07 18.73,29.53 6.03,29.53 2.86,26.35 2.86,5.71 4.45,4.13 10.79,4.13 11.43,4.76 13.34,4.76 14.39,3.71 R89.2 | v68.26,34.61 68.05,34.82 R72.1 C49.2 67.94,37.88 67.94,39.37 68.52,39.95 IC14.1
  Bottom 0.254: v68.26,32.07 v68.26,34.61
N$34  (via drill 0.6)
  Top 0.254: v50.8,34.29 51.12,34.61 R71.2 | v49.53,24.13 49.85,24.45 93.03,24.45 93.34,24.13 v96.2,24.13 | v95.89,10.79 98.42,8.26 106.68,8.26 110.49,4.45 126.36,4.45 127,3.81 138.75,3.81 139.06,3.49 151.13,3.49 152.72,1.91 J18.P3
  Bottom 0.254: v49.53,24.13 50.8,25.4 v50.8,34.29 | v96.2,24.13 95.57,23.5 95.57,11.11 v95.89,10.79
N$35
  Top 0.254: R70.1 R71.1 | R71.1 51.22,37.47 C50.1 R73.2 | R71.1 51.12,38.1 50.8,38.42 IC13.6
N$36  (via drill 0.6)
  Top 0.254: v28.26,53.02 28.89,53.66 60.64,53.66 65.09,58.1 R43.2 | v28.26,13.65 47.94,13.65 53.34,8.26 61.91,8.26 65.72,4.45 74.3,4.45 74.93,3.81 87.31,3.81 87.95,3.17 106.05,3.17 106.68,2.54 115.57,2.54 116.2,1.91 J15.P3
  Bottom 0.254: v28.26,53.02 26.99,51.75 26.99,14.92 v28.26,13.65
N$37
  Top 0.254: 60.64,64.14 IC7.6 60.64,63.5 60.96,63.18 63.5,63.18 | R29.2 C28.1 63.5,63.18 | 63.5,63.18 R42.1 R43.1
N$38
  Top 0.254: R10.2 17.44,78.66 SW1.L1
N$39  (via drill 0.6)
  Top 0.254: v45.72,51.44 R54.2 | v45.72,25.08 v93.98,25.08 | v94.3,4.45 94.93,3.81 106.36,3.81 107,3.17 125.73,3.17 127,1.91 J16.P3
  Bottom 0.254: v93.98,25.08 94.3,24.77 v94.3,4.45 | v45.72,25.08 v45.72,51.44
N$40
  Top 0.254: IC13.13 R54.1 | R54.1 R55.1 | R54.1 45.62,47.94 C41.1 R48.2
N$41  (via drill 0.6)
  Top 0.254: R30.2 27.94,62.55 27.3,61.91 21.59,61.91 19.68,60.01 19.68,57.15 20,56.83 20,55.24 20.64,54.61 20.64,48.58 19.37,47.31 v16.19,47.31
  Bottom 0.254: v16.19,47.31 16.19,35.24 J4.P3
N$42
  Top 0.254: R34.2 C26.1 27.84,65.09 R30.1 R31.1 29.53,65.72 28.89,66.36 IC6.2
N$43
  Top 0.254: J3.P3 9.53,33.02 12.38,35.88 R67.1
N$44
  Top 0.254: IC13.1 IC13.2
N$45
  Top 0.254: IC11.14 136.19,52.09 139.38,48.9 139.38,27.3 137.48,25.4 108.27,25.4 102.55,19.68 37.15,19.68 33.97,16.51 R76.P$2
N$46
  Top 0.254: R65.P$2 131.44,40.32 136.53,45.4 136.53,50.8 135.89,51.44 IC11.13
N$47  (via drill 0.6)
  Top 0.254: IC11.15 136.5,52.73 140.02,49.21 140.02,26.99 137.79,24.77 108.58,24.77 102.87,19.05 47.62,19.05 v46.99,18.41
  Bottom 0.254: R77.P$2 v46.99,18.41
N$48
  Top 0.254: R64.P$2 107.63,36.2 108.27,36.83 115.89,36.83 124.78,45.72 124.78,51.12 127.05,53.38 IC11.1
N$49
  Top 0.254: R61.P$2 36.2,33.66 37.15,32.7 65.09,32.7 65.72,33.34 66.99,33.34 67.31,33.02 69.22,33.02 69.53,32.7 72.39,32.7 73.34,31.75 113.67,31.75 126.68,44.77 126.68,50.16 127.3,50.78 IC11.5
N$50
  Top 0.254: R80.P$2 86.04,16.51 86.68,17.14 103.82,17.14 105.73,19.05 140.97,19.05 142.88,20.95 142.88,24.13 141.92,25.08 141.92,57.15 139.06,60.01 139.06,61.91 137.79,63.18 137.79,65.09 135.88,67.01 IC8.14
N$51
  Top 0.254: R78.P$2 60.01,16.51 61.91,18.41 103.19,18.41 108.9,24.13 138.11,24.13 140.65,26.67 140.65,56.52 137.79,59.37 137.79,61.28 136.53,62.55 136.53,64.45 135.27,65.71 IC8.12
N$52
  Top 0.254: R63.P$2 83.82,33.66 84.45,33.02 113.03,33.02 125.41,45.4 125.41,50.8 127.35,52.73 IC11.2
N$53
  Top 0.254: R62.P$2 60.01,33.66 60.33,33.34 64.77,33.34 65.41,33.97 67.31,33.97 67.63,33.66 69.53,33.66 69.85,33.34 72.71,33.34 73.66,32.38 113.35,32.38 126.05,45.09 126.05,50.48 127,51.44 IC11.4
N$54  (via drill 0.6)
  Top 0.254: v102.87,62.23 100.49,59.85 IC10.44 | v107.31,62.23 108.58,63.5 120.33,63.5 122.24,61.59 122.24,60.96 v121.92,60.64 | v124.14,62.87 124.56,62.45 R44.1
  Bottom 0.254: v102.87,62.23 v107.31,62.23 | v121.92,60.64 v124.14,62.87
N$55
  Top 0.254: IC3.12 136.54,83.17 139.7,80.01 139.7,72.71 140.97,71.44 140.97,67.63 141.6,66.99 141.6,65.09 142.88,63.82 142.88,61.91 145.73,59.05 145.73,49.53 155.26,40.01 R66.P$2
N$56
  Top 0.406: JP3.2 JP3.1 19.05,103.19 D1.A
N$57
  Top 0.254: R81.P$2 105.41,16.83 107,18.41 141.29,18.41 143.51,20.64 143.51,24.45 142.56,25.4 142.56,57.47 139.7,60.33 139.7,62.23 138.43,63.5 138.43,65.41 136.18,67.66 IC8.15
N$58
  Top 0.254: R79.P$2 73.03,16.51 74.3,17.78 103.5,17.78 105.41,19.68 140.65,19.68 142.24,21.27 142.24,23.81 141.29,24.77 141.29,56.83 138.43,59.69 138.43,61.59 137.16,62.87 137.16,64.77 135.57,66.36 IC8.13
N$59
  Top 0.254: R44.2 127.1,60.64 129.22,60.64 LED2.A
N$60
  Top 0.254: R47.2 61.28,57.89 LED1.A
N$61  (via drill 0.6)
  Top 0.406: IC4.3 72.64,81.28 71.44,81.28 68.26,84.45 v68.26,86.68 | v68.26,94.61 67.63,93.98 27.41,93.98 C5.1 27.2,93.98 L1.2
  Bottom 0.406: v68.26,94.61 v68.26,86.68
N$62
  Top 0.254: R26.P$2 147.96,63.5 146.69,64.77 142.88,64.77 142.24,65.41 142.24,67.31 141.6,67.94 141.6,71.75 140.34,73.03 140.34,80.33 136.84,83.82 IC3.13
N$63
  Top 0.254: R8.P$2 131.44,86.36 132.69,85.12 IC3.15
N$64
  Top 0.406: JP3.10 JP3.9 30.48,103.19 D2.C
N$65
  Top 0.254: R82.P$2 118.43,16.51 119.7,17.78 141.6,17.78 144.15,20.32 144.15,24.77 143.19,25.72 143.19,57.78 140.34,60.64 140.34,62.55 139.06,63.82 139.06,65.72 138.43,66.36 138.43,70.17 136.22,72.38 IC5.12
N$66
  Top 0.254: R67.2 Q2.B
N$67  (via drill 0.6)
  Top 0.254: v123.51,83.82 123.51,84.14 117.47,90.17 114.3,90.17 111.76,87.63 107.95,87.63 107.63,87.95 R7.P$2 | v124.46,73.03 IC5.4
  Bottom 0.254: v123.51,83.82 123.51,82.55 125.09,80.96 125.09,76.52 124.46,75.88 v124.46,73.03
N$68
  Top 0.254: IC3.14 134.6,84.45 152.4,84.45 155.26,87.31 R9.P$2
N$69  (via drill 0.6)
  Top 0.254: R6.P$2 83.82,90.49 84.14,90.81 117.79,90.81 124.78,83.82 v124.78,82.87 | v125.41,74.3 127.95,74.3 127.98,74.33 IC5.2
  Bottom 0.254: v124.78,82.87 125.73,81.92 125.73,76.2 125.41,75.88 v125.41,74.3
N$70  (via drill 0.6)
  Top 0.254: 128.92,72.39 IC5.5 126.67,72.38 120.65,66.36 115.25,66.36 v114.94,66.67
  Bottom 0.254: R24.P$2 v114.94,66.67
N$71  (via drill 0.6)
  Top 0.254: v76.52,88.9 76.52,90.49 77.47,91.44 118.11,91.44 126.36,83.19 v126.36,82.55 | v126.36,75.25 126.64,74.97 IC5.1
  Bottom 0.254: R23.P$2 v76.52,88.9 | v126.36,82.55 v126.36,75.25
N$72  (via drill 0.6)
  Top 0.254: v43.5,89.22 43.5,90.49 44.13,91.12 59.69,91.12 60.33,91.76 75.88,91.76 76.83,92.71 118.75,92.71 127.64,83.82 IC3.4 | R25.P$2 v43.5,77.47
  Bottom 0.254: v43.5,77.47 v43.5,89.22
N$73
  Top 0.254: R4.P$2 36.2,90.49 36.83,91.12 43.18,91.12 43.81,91.76 59.37,91.76 60.01,92.39 75.56,92.39 76.52,93.34 119.06,93.34 127.29,85.12 IC3.2
N$74
  Top 0.254: R3.P$2 12.38,90.49 13.02,91.12 35.88,91.12 36.51,91.76 42.86,91.76 43.5,92.39 59.05,92.39 59.69,93.03 75.25,93.03 76.2,93.98 119.38,93.98 127.59,85.77 IC3.1
N$75
  Top 0.254: R5.P$2 60.01,90.49 60.64,91.12 76.2,91.12 77.15,92.08 118.43,92.08 127.33,83.17 IC3.5
N$76
  Top 0.254: R83.P$2 131.44,16.51 132.08,17.14 141.92,17.14 144.78,20 144.78,25.08 143.83,26.04 143.83,58.1 140.97,60.96 140.97,62.87 139.7,64.14 139.7,66.04 139.06,66.67 139.06,70.48 136.53,73.03 IC5.13
N$77
  Top 0.254: R84.P$2 144.46,18.73 145.41,19.68 145.41,25.4 144.46,26.35 144.46,58.42 141.6,61.28 141.6,63.18 140.34,64.45 140.34,66.36 139.7,66.99 139.7,70.8 136.83,73.67 IC5.14
N$78
  Top 0.254: R85.P$2 157.48,19.05 155.57,20.95 155.57,26.67 145.1,37.15 145.1,58.74 142.24,61.59 142.24,63.5 140.97,64.77 140.97,66.67 140.34,67.31 140.34,71.12 137.13,74.33 IC5.15
N$79  (via drill 0.6)
  Top 0.254: v99.06,77.15 98.74,77.15 97.47,78.42 72.71,78.42 66.67,84.45 57.78,84.45 v57.47,84.77 | v98.42,65.72 98.11,65.41 98.11,60.64 98.99,59.76 IC10.41 | v57.47,57.47 57.78,57.78 R47.1
  Bottom 0.254: v99.06,77.15 99.06,76.2 98.11,75.25 98.11,74.61 97.47,73.98 97.47,68.26 98.42,67.31 v98.42,65.72 | v57.47,57.47 57.47,60.64 57.15,60.96 57.15,63.5 57.47,63.82 v57.47,84.77
N$80
  Top 0.406: L2.2 7.37,88.1 C4.1 7.52,86.78 7.94,86.36 9.27,86.36 IC2.3
RESET  (via drill 0.6)
  Top 0.254: R45.1 159.7,63.18 159.29,63.59 SW2.B | SW2.B SW2.B' | 115.57,51.44 121.92,51.44 125.73,55.24 129.22,55.24 131.44,57.47 137.16,57.47 137.48,57.15 v138.75,57.15 | SW2.B 156.94,63.59 156.21,62.87 156.21,58.74 155.57,58.1 v153.35,58.1 | v100.97,57.15 100.65,56.83 100.65,54.93 101.28,54.29 108.27,54.29 111.12,51.44 115.57,51.44 | v100.33,66.99 99.49,67.83 IC10.7 | 115.57,51.44 JP1.10
  Bottom 0.254: v138.75,57.15 139.06,56.83 152.4,56.83 153.35,57.78 v153.35,58.1 | v100.33,66.99 100.33,60.64 100.97,60.01 v100.97,57.15
RIN  (via drill 0.6)
  Top 0.254: 98.74,44.77 99.92,44.77 IC12.19 98.71,44.74 96.84,42.86 96.84,38.42 95.25,36.83 v95.25,34.29 | v95.25,30.8 94.93,31.11 73.34,31.11 71.75,29.53 30.16,29.53 26.99,26.35 26.99,22.23 26.66,21.89 C55.+
  Bottom 0.254: v95.25,30.8 v95.25,34.29
ROUT
  Top 0.254: IC12.13 91.36,42.79 90.81,42.23 90.81,40.01 89.22,38.42 80.33,38.42 78.44,36.52 C53.+
ROUT_JACK
  Top 0.254: R88.1 12.28,1.91 J7.P3
RX  (via drill 0.6)
  Top 0.254: 100.01,58.55 IC10.43 99.99,54.63 100.97,53.66 107.95,53.66 110.81,50.8 122.24,50.8 126.05,54.61 129.54,54.61 131.76,56.83 136.84,56.83 137.48,56.2 v137.79,56.2 | v154.31,60.64 154.62,60.96 154.62,73.66 160.66,79.69 JP2.4
  Bottom 0.254: v137.79,56.2 152.72,56.2 154.31,57.78 v154.31,60.64
SW_GATE
  Top 0.254: IC10.9 98.49,72.32 98.11,72.71 98.11,75.88 96.84,77.15 72.07,77.15 66.04,83.19 24.77,83.19 22.54,80.96 22.54,78.42 18.73,74.61 15.88,74.61 14.92,73.66 SW1.P5 SW1.P2
TX  (via drill 0.6)
  Top 0.254: IC10.42 99.49,54.18 100.65,53.02 107.63,53.02 110.49,50.16 122.56,50.16 126.36,53.98 129.86,53.98 132.08,56.2 136.53,56.2 137.48,55.24 v139.06,55.24 | v155.26,59.37 155.26,72.39 160.02,77.15 JP2.5
  Bottom 0.254: v139.06,55.24 140.97,55.24 141.29,55.56 153.03,55.56 155.26,57.78 v155.26,59.37
VCC  (via drill 0.6)
  Top 0.254: IC14.8 68.42,45.3 C44.1 66.89,45.4 v65.72,45.4 | v70.17,31.75 69.22,30.8 v21.59,30.8
  Top 0.406: D1.C 7.3,103.19 3.81,99.69 C3.+ 5.25,95.08 6.35,93.98 | L1.1 v20.95,93.98 6.35,93.98 | L2.1 5.71,89.59 5.71,91.44 6.35,92.08 6.35,93.98
  Bottom 0.254: v65.72,45.4 66.67,44.45 66.67,40.32 70.17,36.83 v70.17,31.75 | v21.59,30.8 21.91,31.11 21.91,91.76 20.95,92.71 v20.95,93.98
VEE  (via drill 0.6)
  Top 0.254: v75.25,40.01 74.93,39.69 74.08,39.69 C45.2 72.55,39.79 IC14.4 | v72.07,31.43 70.8,30.16 22.54,30.16 v21.91,29.53 | v23.5,96.2 25.4,98.11 30.8,98.11 33.66,100.97 C1.- | C1.- 44.23,100.89 | R2.1 R1.1 43.81,98.11 44.3,98.6 C1.-
  Top 0.406: D2.A 42.86,103.19 44.3,101.75 C1.-
  Bottom 0.254: v72.07,31.43 72.07,36.83 v75.25,40.01 | v21.91,29.53 22.54,30.16 22.54,95.25 v23.5,96.2

## Text on the board
tPlace: TP1 ADC_SCAN
tNames: RESET | SYSBOOT | Elements | cc-by-sa Émilie Gillet, 2014. v0.2
bNames: Red | Stripe | Elements | cc-by-sa Émilie Gillet, 2014. v0.2 | +12V | GND | GND | GND | -12V | Serial | GND | <TX | JTAG